# Altium schematic sheet PlacaDeMedicion.SchDoc
size A4
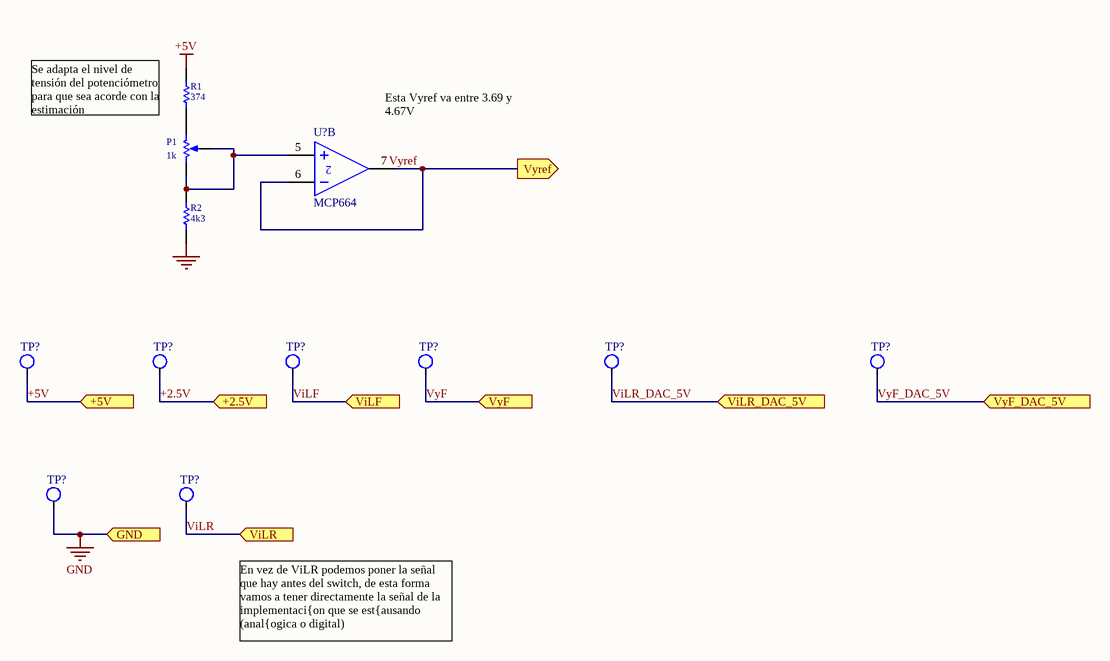
[diagram p0: PlacaDeMedicion.SchDoc]

## Parts
(Parts that share a designator on the sheet are numbered #1, #2 ... from top to bottom, then left to right.)
P1  value 1k  [BOR3]  (hidden comment: RPot)
R1  374  [R1206]
R2  4k3  [R1206]
TP?#1  Vyr  [TestPoint Keystone 5000 Silver-Red]  (value not drawn)
TP?#2  Vyr  [TestPoint Keystone 5000 Silver-Red]  (value not drawn)
TP?#3  Vyr  [TestPoint Keystone 5000 Silver-Red]  (value not drawn)
TP?#4  Vyr  [TestPoint Keystone 5000 Silver-Red]  (value not drawn)
TP?#5  Vyr  [TestPoint Keystone 5000 Silver-Red]  (value not drawn)
TP?#6  Vyr  [TestPoint Keystone 5000 Silver-Red]  (value not drawn)
TP?#7  Vyr  [TestPoint Keystone 5000 Silver-Red]  (value not drawn)
TP?#8  Vyr  [TestPoint Keystone 5000 Silver-Red]  (value not drawn)
U?  MCP664  [SOIC14]  (part B of 4)

## Ports
+2.5V (in), +5V (in), GND (in), ViLF (in), ViLR (in), ViLR_DAC_5V (in), VyF (in), VyF_DAC_5V (in), Vyref (out)

## Nets
+5V: R1.2 TP?#1.1 ; port +5V
GND: R2.1 TP?#7.1 ; port GND
+2.5V: TP?#2.1 ; port +2.5V
ViLF: TP?#3.1 ; port ViLF
ViLR: TP?#8.1 ; port ViLR
ViLR_DAC_5V: TP?#5.1 ; port ViLR_DAC_5V
VyF: TP?#4.1 ; port VyF
VyF_DAC_5V: TP?#6.1 ; port VyF_DAC_5V
Vyref: U?.6(IN-) U?.7(OUT) ; port Vyref
NetP1_1: P1.1(TOP) R1.1
NetP1_2: P1.2(TAP) P1.3(BOT) R2.2 U?.5(IN+)

## Notes on the sheet
- Se adapta el nivel de tensión del potenciómetro para que sea acorde con la estimación
- (near U?) Esta Vyref va entre 3.69 y 4.67V
- En vez de ViLR podemos poner la señal que hay antes del switch, de esta forma vamos a tener directamente la señal de la implementaci{on que se est{ausando (anal{ogica o digital)
- Labels drawn without touching a wire or pin: Vyref

## Library data of the parts
P1 = RPot: Potentiometer; Sim Note: Enter the Resistance value and the set point into parameter fields.; Set Position: 0.5; Published: 8-Jun-2000; LatestRevisionDate: 17-Jul-2002; LatestRevisionNote: Re-released for DXP Platform.; PackageReference: VR5; Publisher: Altium Limited
R1 R2 = R1206: Resistor Chip; 1/8W;; Published: 8-Jun-2000; LatestRevisionDate: 26/8/2013; PackageReference: 1206; Publisher: Altium Limited; PackageDescription: SMT Chip Resistor; Supplier 1: Digi-Key
  R1: Value: 374
  R2: Value: 4k3
TP?#1-TP?#8 = Tespoint: Test point; Link: https://www.digikey.com/en/products/detail/keystone-electronics/5000/255326
U? = MCP664: Datasheet: https://ar.mouser.com/datasheet/2/268/22194B-77503.pdf